# EAGLE design nano.3 (EAGLE 7.6.0)
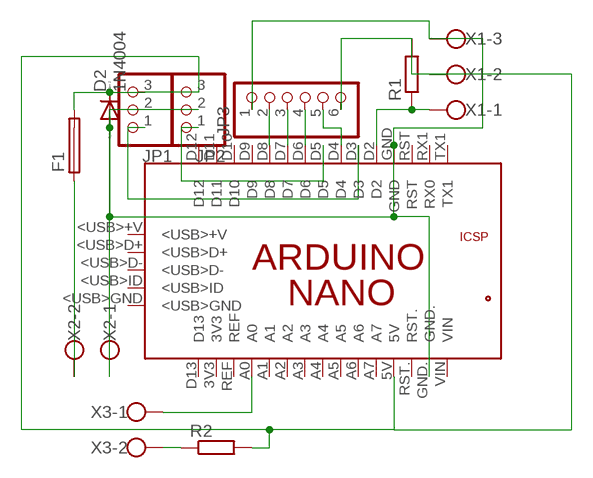
[diagram p0: schematic, sheet 1]

## Parts
D2  1N4004  [DO41-10]
F1  GSH15  [GSH15]
JP1  PINHD-1X3  [1X03]
JP2  PINHD-1X3  [1X03]
JP3  PINHD-1X6  [1X06]
PCB2  ARDUINO_NANO  [ARDUINO_NANO]
R1  R-EU_0207/15  [0207/15]
R2  R-EU_0204/7  [0204/7]
X1  W237-103  [W237-103]
X2  W237-102  [W237-102]
X3  W237-102  [W237-102]

## Nets
N$1: D2.C F1.2 JP1.3 JP2.3 JP3.6 PCB2.5V R1.2 R2.2 X1.2
N$2: D2.A JP1.2 JP2.2 JP3.1 PCB2.GND PCB2.GND. X1.3 X2.1
N$3: R2.1 X3.2
N$4: PCB2.A0 X3.1
N$6: JP3.2 PCB2.D8
N$7: JP3.3 PCB2.D7
N$8: JP3.4 PCB2.D6
N$9: JP3.5 PCB2.D4
N$10: JP2.1 PCB2.D5
N$11: PCB2.D2 R1.1 X1.1
N$12: JP1.1 PCB2.D3
N$14: F1.1 X2.2
Unconnected: PCB2.3V3 PCB2.5V. PCB2.<USB>+V PCB2.<USB>D+ PCB2.<USB>D- PCB2.<USB>GND PCB2.<USB>ID PCB2.A1 PCB2.A2 PCB2.A3 PCB2.A4 PCB2.A5 PCB2.A6 PCB2.A7 PCB2.D9 PCB2.D10 PCB2.D11 PCB2.D12 PCB2.D13 PCB2.GND_ PCB2.MISO PCB2.MOSI PCB2.REF PCB2.RESET.. PCB2.RST PCB2.RST. PCB2.RX1(RX0) PCB2.SCK PCB2.TX1 PCB2.VIN

## Library data of the parts
D2 = diode:1N4004: DIODE general purpose rectifier, 1 A
F1 = fuse:GSH15: FUSE HOLDER grid 15mm, 19649 Wickmann; MPN: 64900001039; OC_FARNELL: 1271673; OC_NEWARK: 02P0318
JP1 JP2 = pinhead:PINHD-1X3: PIN HEADER
JP3 = pinhead:PINHD-1X6: PIN HEADER
PCB2 = E14_Arduino_revB:ARDUINO_NANO: Device for representing an Arduino Nano board with a footprint in an EAGLE design. Created by Dave Young for Element14. More EAGLE documentation at: http://www.element14.com/community/community/knode/cadsoft_eagle
R1 R2 = resistor:R-EU_: RESISTOR, European symbol
X1 = con-wago-500:W237-103: WAGO SCREW CLAMP; MPN: 237-103; OC_FARNELL: unknown; OC_NEWARK: 18M7116
X2 X3 = con-wago-500:W237-102: WAGO SCREW CLAMP; MPN: 237-102; OC_FARNELL: unknown; OC_NEWARK: 70K9898

## Board
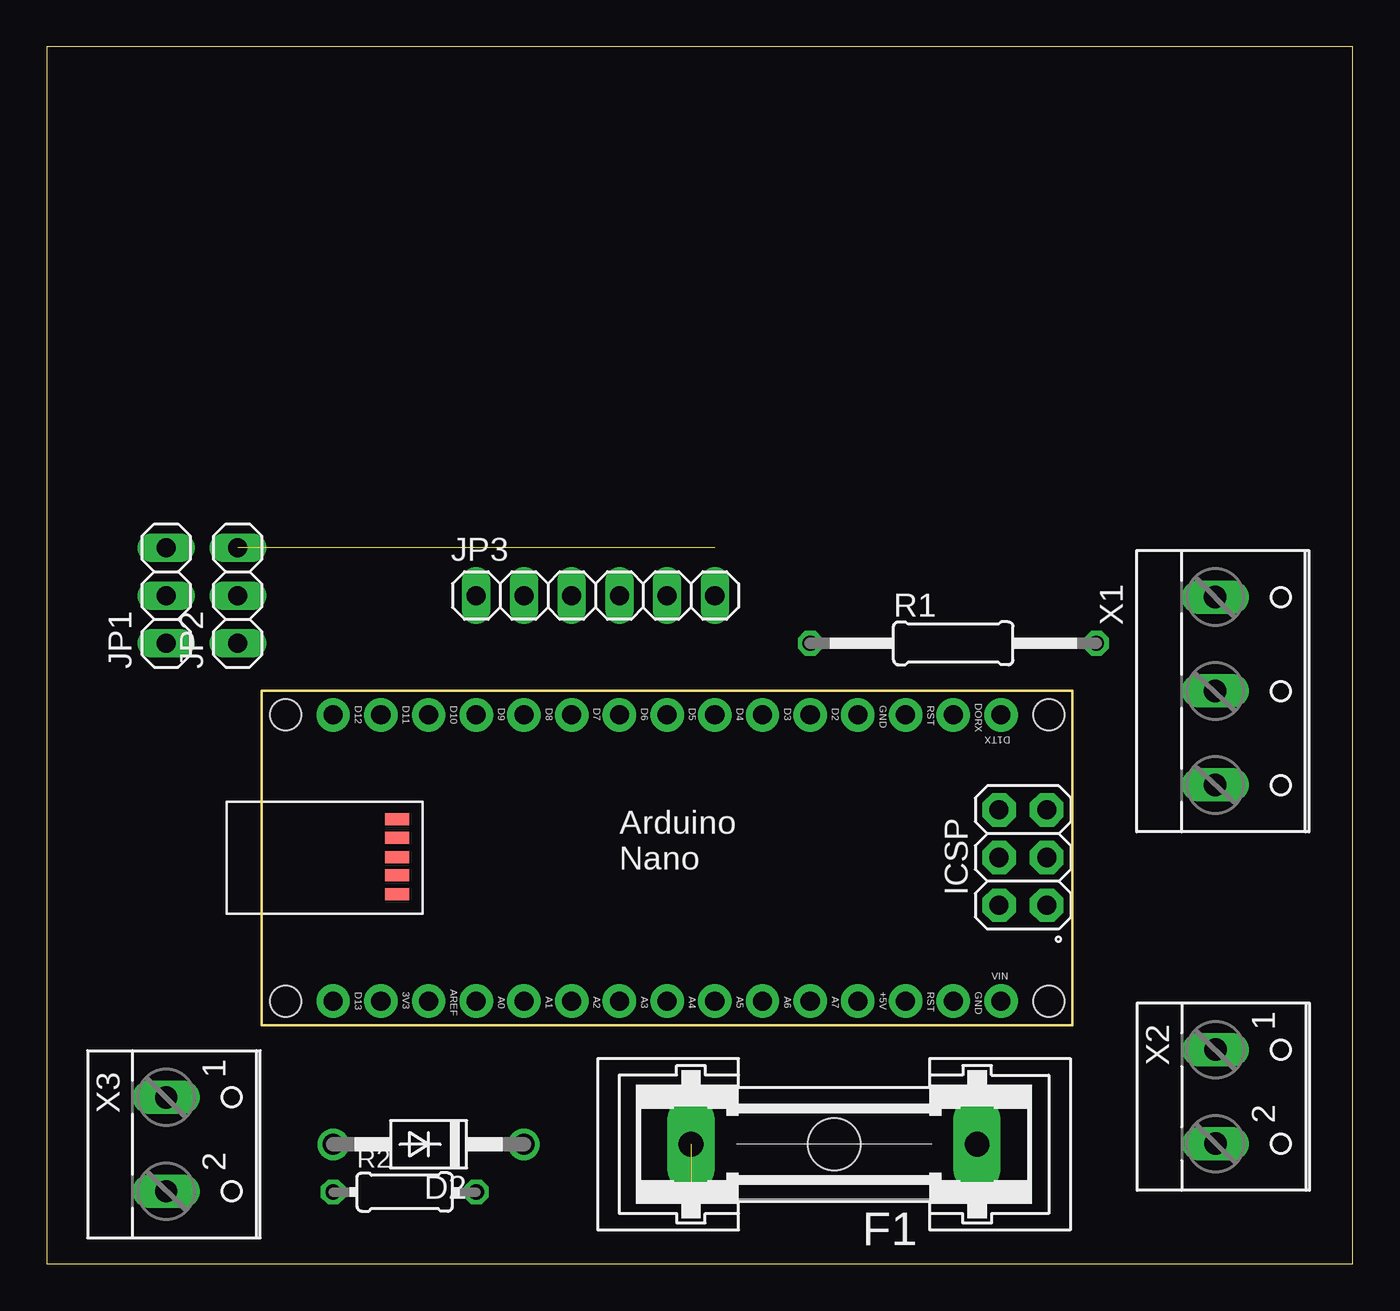
[diagram p1: board, top side]
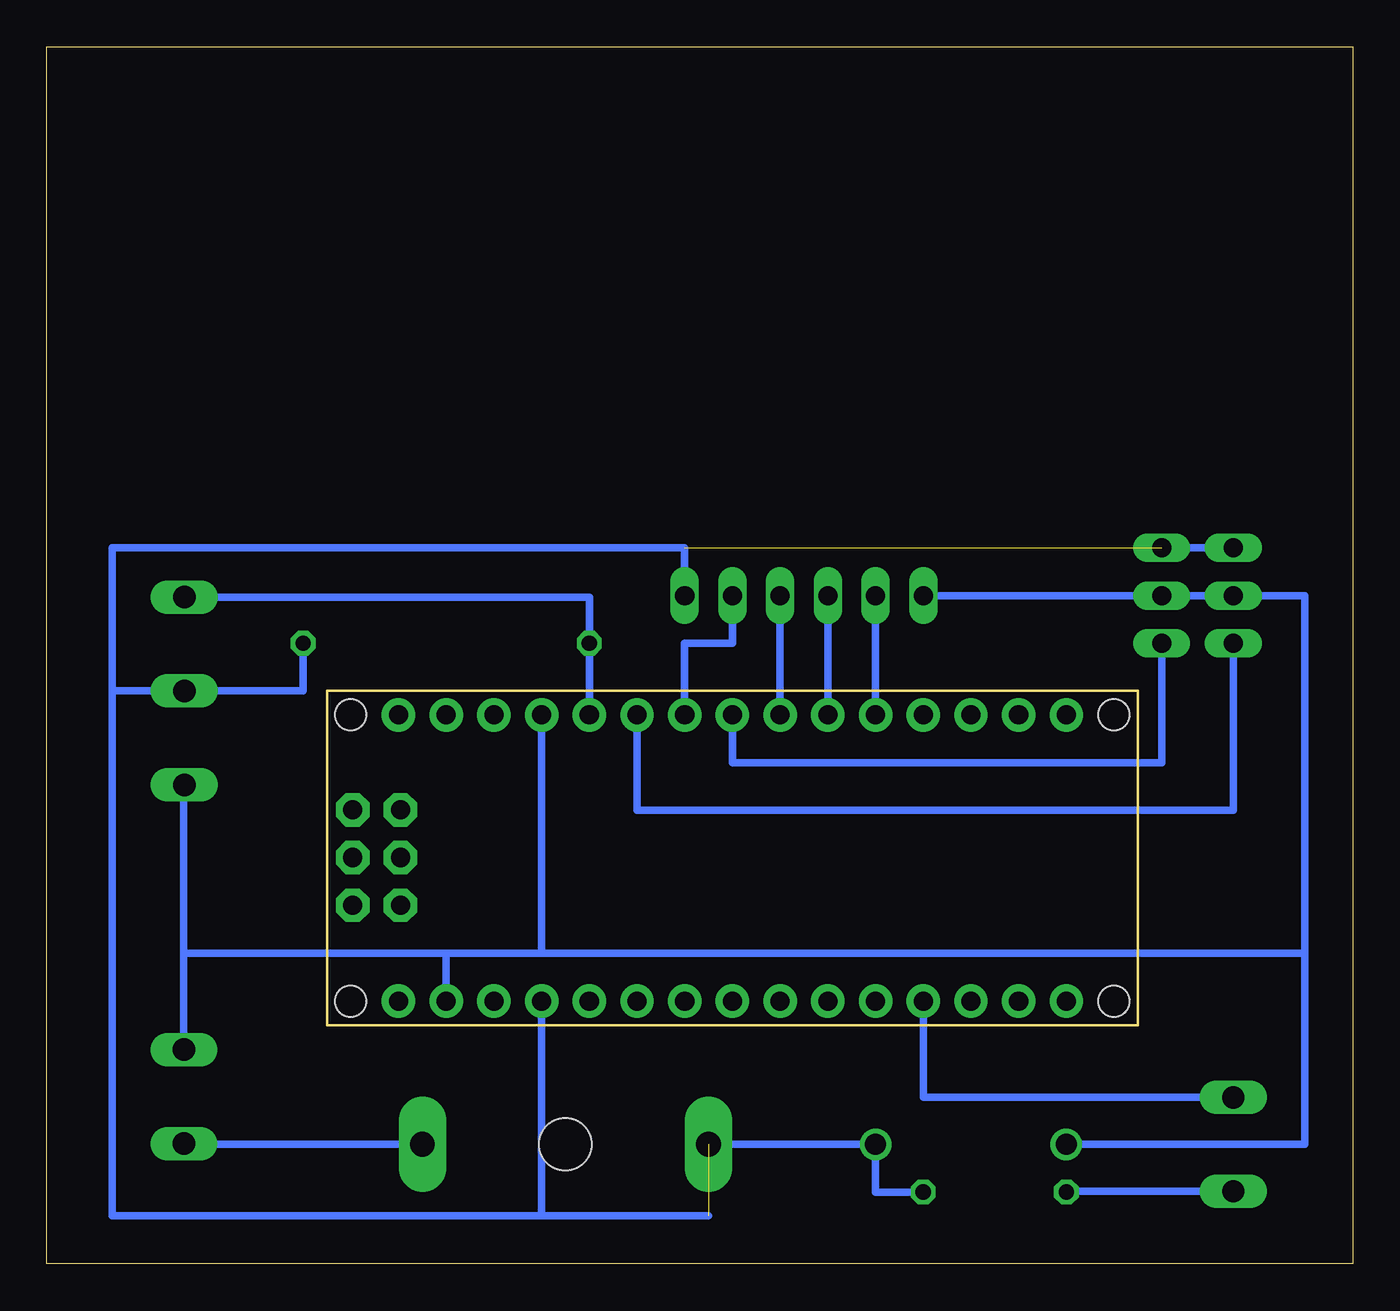
[diagram p2: board, bottom side, seen from below]

Size 69.52 x 64.76 mm. Coordinates in mm from the lower left corner, seen from the top.
Outline: 0,0 69.52,0 69.52,64.76 0,64.76 0,0
Copper layers (1*16): Top 0.035mm / dielectric 1.5mm / Bottom 0.035mm
Design rules "default": minimum track width 10mil, minimum drill 24mil, track to track 8mil, track to pad 8mil, pad to pad 8mil, via to via 8mil, smd to smd 8mil, copper to edge 40mil, drill to drill 8mil, minimum pad ring 10mil, minimum via ring 8mil, stop-mask expansion 4mil, vias tented up to drill 0mil, thermal gap 10mil

### Footprints (pad centres in the part's own frame; a part is rotated, then mirrored left to right if it is on the bottom)
DO41-10 = drill 1.118: A 5.08,0; C -5.08,0
GSH15 = drill 1.321 pad 2.54 long: 1 -7.62,0; 2 7.62,0 | hole 2.794: 0,0
1X03 = drill 1.016 long: 1 -2.54,0; 2 0,0; 3 2.54,0
1X06 = drill 1.016 long: 1 -6.35,0; 2 -3.81,0; 3 -1.27,0; 4 1.27,0; 5 3.81,0; 6 6.35,0
ARDUINO_NANO = drill 1.016 pad 1.778: 3V3 6.35,1.27; 5V 31.75,1.27; A0 11.43,1.27; A1 13.97,1.27; A2 16.51,1.27; A3 19.05,1.27; A4 21.59,1.27; A5 24.13,1.27; A6 26.67,1.27; A7 29.21,1.27; D2 29.21,16.51; D3 26.67,16.51; D4 24.13,16.51; D5 21.59,16.51; D6 19.05,16.51; D7 16.51,16.51; D8 13.97,16.51; D9 11.43,16.51; D10 8.89,16.51; D11 6.35,16.51; D12 3.81,16.51; D13 3.81,1.27; GND 31.75,16.51; GND. 36.83,1.27; REF 8.89,1.27; RST 34.29,16.51; RST. 34.29,1.27; RX1 36.83,16.51; TX1 39.37,16.51; VIN 39.37,1.27 | drill 1.016 pad 1.778 octagon: 5V. 39.268,6.375; GND_ 39.268,11.455; MISO 41.808,6.375; MOSI 39.268,8.915; RESET.. 41.808,11.455; SCK 41.808,8.915 | smd 1.27 x 0.635: <USB>+V 7.214,10.947; <USB>D+ 7.214,9.957; <USB>D- 7.214,8.941; <USB>GND 7.214,6.96; <USB>ID 7.214,7.976 | hole 1.651: 1.27,1.27; 1.27,16.51; 41.91,16.51; 41.91,1.27
0207/15 = drill 0.813 octagon: 1 -7.62,0; 2 7.62,0
0204/7 = drill 0.813 octagon: 1 -3.81,0; 2 3.81,0
W237-103 = drill 1.194 long: 1 -5,-1.29; 2 0,-1.29; 3 5,-1.29
W237-102 = drill 1.194 long: 1 -2.5,-1.27; 2 2.5,-1.27

### Placement (x,y rotation side)
D2  20.32,6.35 180 top
F1  41.91,6.35 180 top
JP1  6.35,35.56 90 top
JP2  10.16,35.56 90 top
JP3  29.21,35.56 0 top
PCB2  11.43,12.7 0 top
R1  48.26,33.02 0 top
R2  19.05,3.81 0 top
X1  63.5,30.48 270 top
X2  63.5,8.89 270 top
X3  7.62,6.35 270 top

### Tracks (layer width: path | path; a pad name or v marks a point on that pad's centre or on a via)
N$1  (2 unrouted)
  Bottom 0.406: 43.18,2.54 66.04,2.54 66.04,30.48 | PCB2.5V 43.18,2.54 | 66.04,30.48 X1.2 55.88,30.48 R1.2 | 66.04,30.48 66.04,38.1 35.56,38.1 JP3.6 | 34.29,2.54 43.18,2.54 | JP2.3 JP1.3 | F1.2 D2.C 25.4,3.81 R2.2
N$2
  Bottom 0.406: PCB2.GND 43.18,16.51 | 43.18,16.51 2.54,16.51 | D2.A 2.54,6.35 2.54,16.51 | 2.54,16.51 2.54,35.56 JP1.2 JP2.2 JP3.1 | X2.1 62.23,16.51 | 62.23,16.51 62.23,25.48 X1.3 | 48.26,16.51 43.18,16.51 | PCB2.GND. 48.26,16.51 | 48.26,16.51 62.23,16.51
N$3
  Bottom 0.406: X3.2 15.24,3.85 R2.1
N$4
  Bottom 0.406: X3.1 22.86,8.85 PCB2.A0
N$6
  Bottom 0.406: JP3.2 PCB2.D8
N$7
  Bottom 0.406: JP3.3 PCB2.D7
N$8
  Bottom 0.406: JP3.4 PCB2.D6
N$9
  Bottom 0.406: JP3.5 33.02,33.02 35.56,33.02 PCB2.D4
N$10
  Bottom 0.406: 33.02,27.94 PCB2.D5 33.02,26.67 10.16,26.67 JP2.1
N$11
  Bottom 0.406: X1.1 40.64,35.48 R1.1 PCB2.D2
N$12
  Bottom 0.406: 38.1,25.4 PCB2.D3 38.1,24.13 6.35,24.13 JP1.1
N$14
  Bottom 0.406: F1.1 62.23,6.35 X2.2